# Altium schematic sheet PC104Plus-ESP32-Module.SchDoc: ESP32 PCB
size A3; SheetNumber: 1; SheetTotal: 1
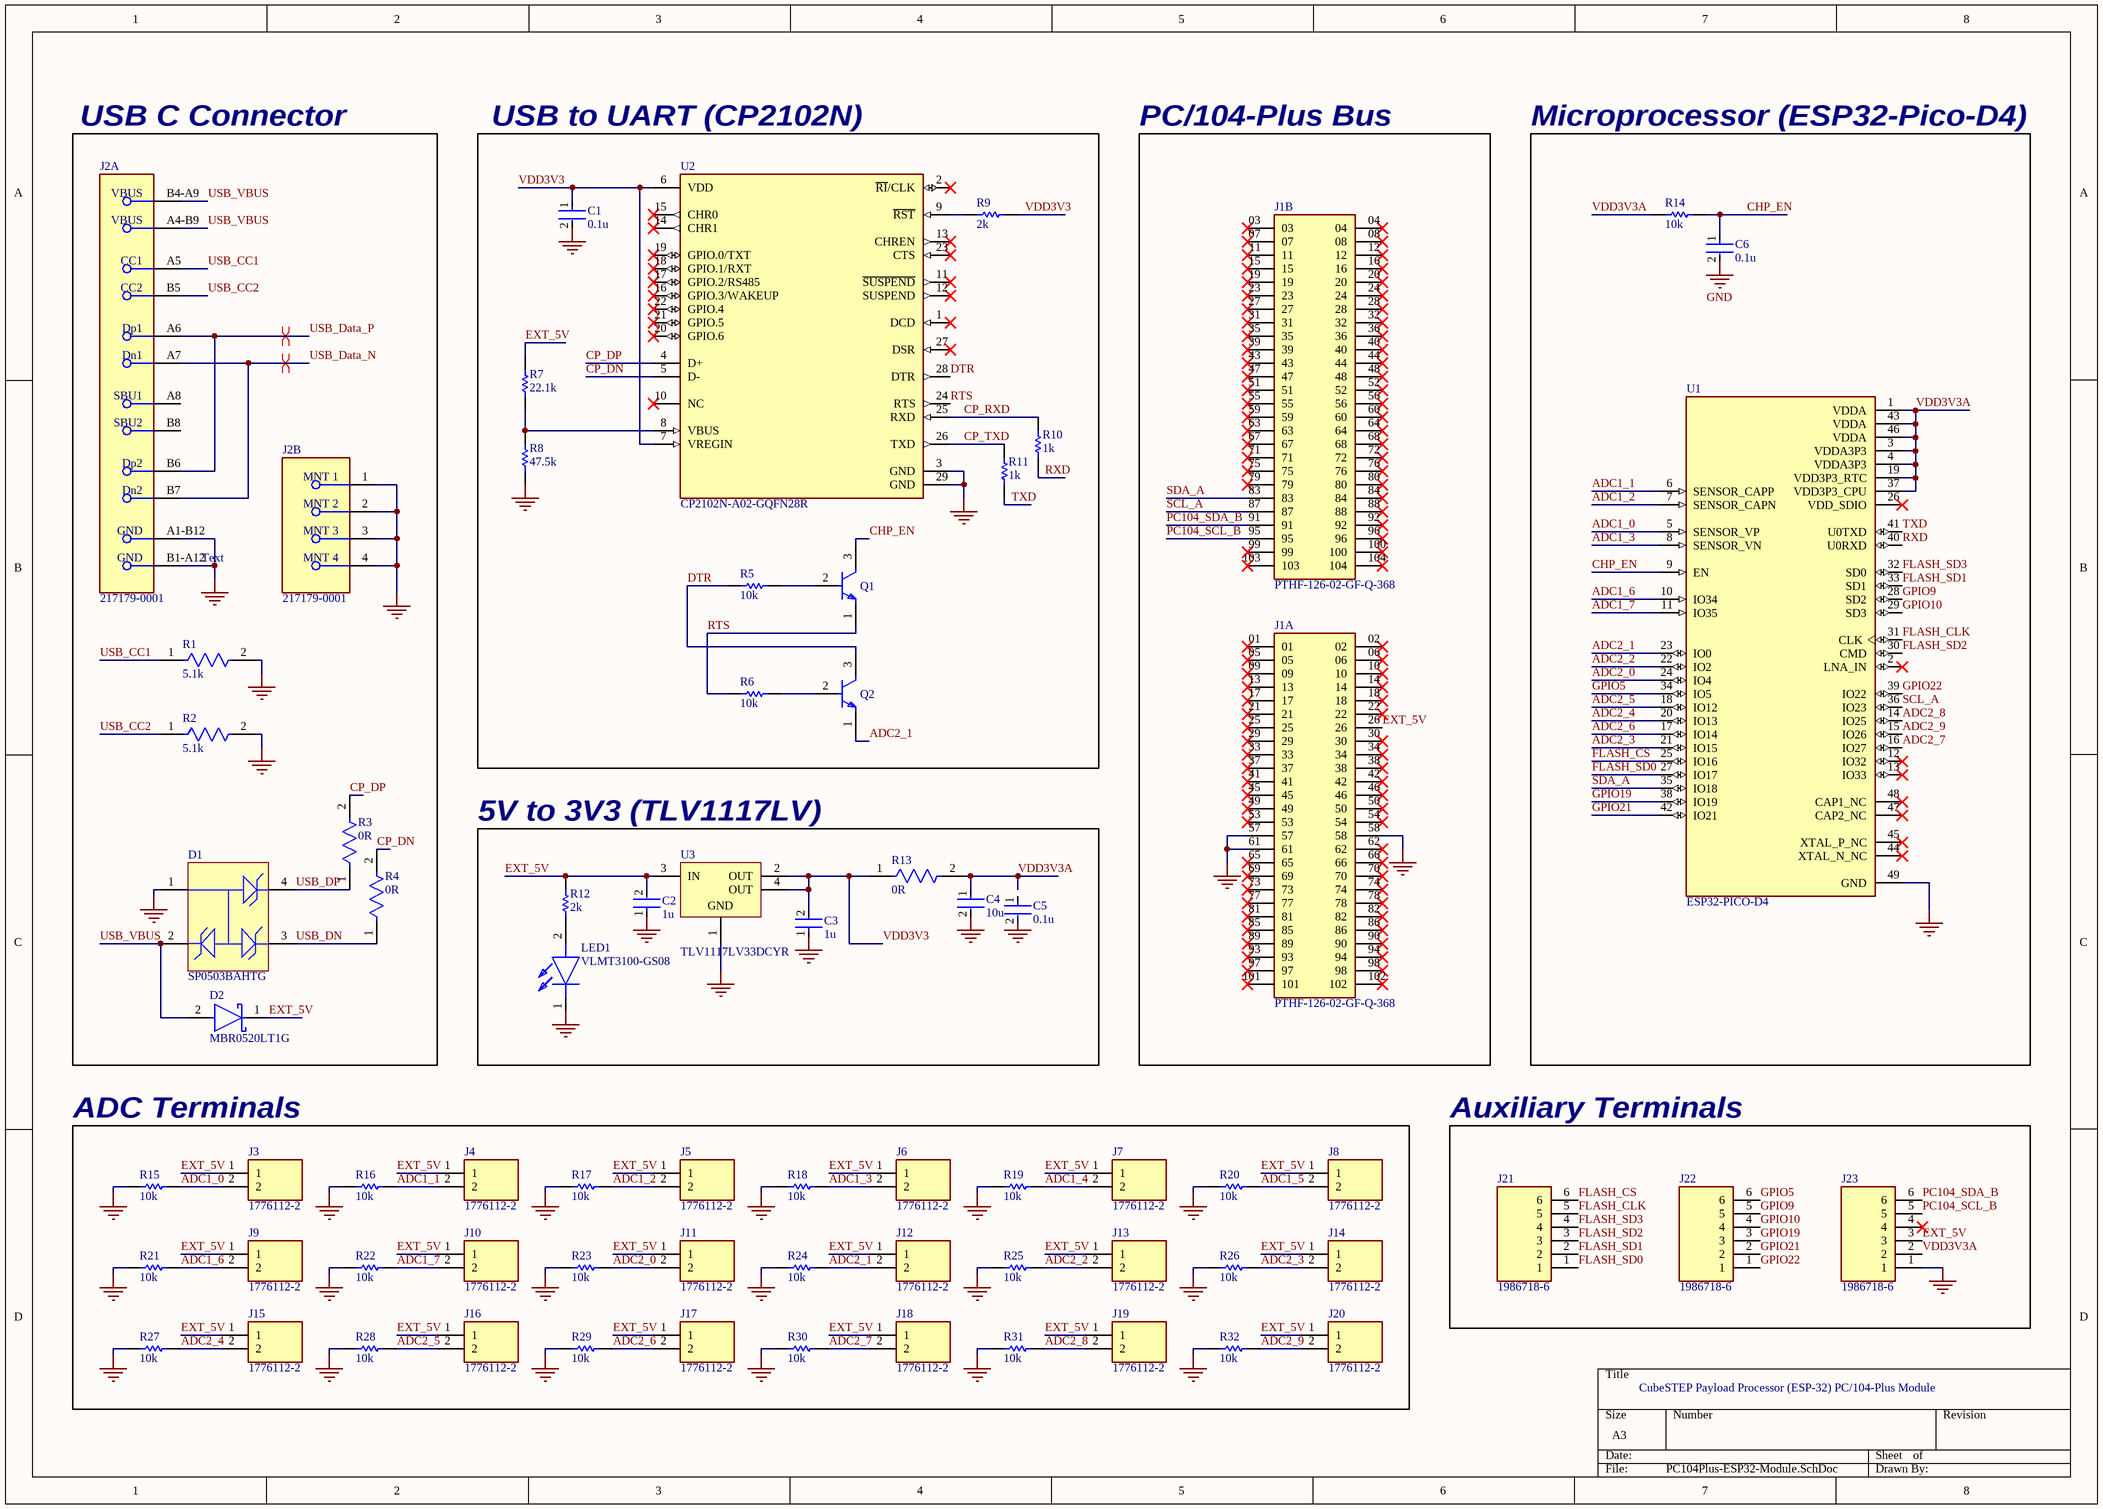
[diagram p0: PC104Plus-ESP32-Module.SchDoc]

## Parts
C1  0.1u  [FP-CL31-IPC_B]
C2  1u  [FP-CL10-IPC_C]
C3  1u  [FP-CL10-IPC_C]
C4  10u  [FP-CL21-IPC_A]
C5  0.1u  [FP-CL31-IPC_B]
C6  0.1u  [FP-CL31-IPC_B]
D1  SP0503BAHTG  [LFUS-SOT143-4_V]
D2  MBR0520LT1G  [FP-425-04-IPC_C]
J1  PTHF-126-02-GF-Q-368  [SAMTEC_PTHF-126-02-GF-Q-368]  (parts A,B of 2)
J2  217179-0001  [FP-217179-0001-MFG]  (parts A,B of 2)
J3  1776112-2  [TE_1776112-2]
J4  1776112-2  [TE_1776112-2]
J5  1776112-2  [TE_1776112-2]
J6  1776112-2  [TE_1776112-2]
J7  1776112-2  [TE_1776112-2]
J8  1776112-2  [TE_1776112-2]
J9  1776112-2  [TE_1776112-2]
J10  1776112-2  [TE_1776112-2]
J11  1776112-2  [TE_1776112-2]
J12  1776112-2  [TE_1776112-2]
J13  1776112-2  [TE_1776112-2]
J14  1776112-2  [TE_1776112-2]
J15  1776112-2  [TE_1776112-2]
J16  1776112-2  [TE_1776112-2]
J17  1776112-2  [TE_1776112-2]
J18  1776112-2  [TE_1776112-2]
J19  1776112-2  [TE_1776112-2]
J20  1776112-2  [TE_1776112-2]
J21  1986718-6  [TE_1986718-6]
J22  1986718-6  [TE_1986718-6]
J23  1986718-6  [TE_1986718-6]
LED1  VLMT3100-GS08  [VLMT3100-GS08]
Q1  SS8050CBU  (value not drawn)
Q2  SS8050CBU  (value not drawn)
R1  5.1k  [FP-ERJ3EK-MFG]
R2  5.1k  [FP-ERJ3EK-MFG]
R3  0R  [FP-ERJ1GN-MFG]
R4  0R  [FP-ERJ1GN-MFG]
R5  10k  [RESC1609X55X30LL15T15]
R6  10k  [RESC1609X55X30LL15T15]
R7  22.1k  [RESC2013X70X40NL20T20]
R8  47.5k  [RESC1005X40X25NL05T05]
R9  2k  [RESC1005X40X25LL05T05]
R10  1k  [RESC2013X70X40ML20T20]
R11  1k  [RESC2013X70X40ML20T20]
R12  2k  [RESC1005X40X25LL05T05]
R13  0R  [FP-ERJ1GN-MFG]
R14  10k  [RESC1609X55X30LL15T15]
R15  10k  [RESC1609X55X30LL15T15]
R16  10k  [RESC1609X55X30LL15T15]
R17  10k  [RESC1609X55X30LL15T15]
R18  10k  [RESC1609X55X30LL15T15]
R19  10k  [RESC1609X55X30LL15T15]
R20  10k  [RESC1609X55X30LL15T15]
R21  10k  [RESC1609X55X30LL15T15]
R22  10k  [RESC1609X55X30LL15T15]
R23  10k  [RESC1609X55X30LL15T15]
R24  10k  [RESC1609X55X30LL15T15]
R25  10k  [RESC1609X55X30LL15T15]
R26  10k  [RESC1609X55X30LL15T15]
R27  10k  [RESC1609X55X30LL15T15]
R28  10k  [RESC1609X55X30LL15T15]
R29  10k  [RESC1609X55X30LL15T15]
R30  10k  [RESC1609X55X30LL15T15]
R31  10k  [RESC1609X55X30LL15T15]
R32  10k  [RESC1609X55X30LL15T15]
U1  ESP32-PICO-D4  [PQFN50P700X700X104-49N]
U2  CP2102N-A02-GQFN28R  [FP-CP2102N-A02-GQFN28R-MFG]
U3  TLV1117LV33DCYR  [DCY0004A_N]

## Blocks framed on the sheet
USB C Connector: D1 D2 J2 R1-R4
USB to UART (CP2102N): C1 Q1 Q2 R5-R11 U2
PC/104-Plus Bus: J1
Microprocessor (ESP32-Pico-D4): C6 R14 U1
5V to 3V3 (TLV1117LV): C2-C5 LED1 R12 R13 U3
ADC Terminals: J3-J20 R15-R32
Auxiliary Terminals: J21-J23

## Nets
GND: C1.2 C2.1 C3.1 C4.2 C5.2 C6.2 D1.1 J1.57 J1.58 J1.61 J2.1(MNT_1) J2.2(MNT_2) J2.3(MNT_3) J2.4(MNT_4) J2.A1-B12(GND) J2.B1-A12(GND) J23.1 LED1.1(K) R1.2 R2.2 R8.1 R15.2 R16.2 R17.2 R18.2 R19.2 R20.2 R21.2 R22.2 R23.2 R24.2 R25.2 R26.2 R27.2 R28.2 R29.2 R30.2 R31.2 R32.2 U1.49(GND) U2.3(GND) U2.29(GND) U3.1(GND)
ADC1_0: J3.2 R15.1 U1.5(SENSOR_VP)
ADC1_1: J4.2 R16.1 U1.6(SENSOR_CAPP)
ADC1_2: J5.2 R17.1 U1.7(SENSOR_CAPN)
ADC1_3: J6.2 R18.1 U1.8(SENSOR_VN)
ADC1_4: J7.2 R19.1
ADC1_5: J8.2 R20.1
ADC1_6: J9.2 R21.1 U1.10(IO34)
ADC1_7: J10.2 R22.1 U1.11(IO35)
ADC2_0: J11.2 R23.1 U1.24(IO4)
ADC2_1: J12.2 Q2.1(E) R24.1 U1.23(IO0)
ADC2_2: J13.2 R25.1 U1.22(IO2)
ADC2_3: J14.2 R26.1 U1.21(IO15)
ADC2_4: J15.2 R27.1 U1.20(IO13)
ADC2_5: J16.2 R28.1 U1.18(IO12)
ADC2_6: J17.2 R29.1 U1.17(IO14)
ADC2_7: J18.2 R30.1 U1.16(IO27)
ADC2_8: J19.2 R31.1 U1.14(IO25)
ADC2_9: J20.2 R32.1 U1.15(IO26)
CHP_EN: C6.1 Q1.3(C) R14.1 U1.9(EN)
CP_DN: R4.2 U2.5(D-)
CP_DP: R3.2 U2.4(D+)
CP_RXD: R10.1 U2.25(RXD)
CP_TXD: R11.1 U2.26(TXD)
DTR: Q2.3(C) R5.2 U2.28(DTR)
EXT_5V: C2.2 D2.1(C) J1.26 J3.1 J4.1 J5.1 J6.1 J7.1 J8.1 J9.1 J10.1 J11.1 J12.1 J13.1 J14.1 J15.1 J16.1 J17.1 J18.1 J19.1 J20.1 J23.3 R7.2 R12.2 U3.3(IN)
FLASH_CLK: J21.5 U1.31(CLK)
FLASH_CS: J21.6 U1.25(IO16)
FLASH_SD0: J21.1 U1.27(IO17)
FLASH_SD1: J21.2 U1.33(SD1)
FLASH_SD2: J21.3 U1.30(CMD)
FLASH_SD3: J21.4 U1.32(SD0)
GPIO5: J22.6 U1.34(IO5)
GPIO9: J22.5 U1.28(SD2)
GPIO10: J22.4 U1.29(SD3)
GPIO19: J22.3 U1.38(IO19)
GPIO21: J22.2 U1.42(IO21)
GPIO22: J22.1 U1.39(IO22)
PC104_SCL_B: J1.95 J23.5
PC104_SDA_B: J1.91 J23.6
RTS: Q1.1(E) R6.2 U2.24(RTS)
RXD: R10.2 U1.40(U0RXD)
SCL_A: J1.87 U1.36(IO23)
SDA_A: J1.83 U1.35(IO18)
TXD: R11.2 U1.41(U0TXD)
USB_CC1: J2.A5(CC1) R1.1
USB_CC2: J2.B5(CC2) R2.1
USB_Data_N: J2.A7(Dn1) J2.B7(Dn2)
USB_Data_P: J2.A6(Dp1) J2.B6(Dp2)
USB_DN: D1.3 R4.1
USB_DP: D1.4 R3.1
USB_VBUS: D1.2 D2.2(A) J2.A4-B9(VBUS) J2.B4-A9(VBUS)
VDD3V3: C1.1 C3.2 R9.2 R13.1 U2.6(VDD) U2.7(VREGIN) U3.2(OUT) U3.4(OUT)
VDD3V3A: C4.1 J23.2 R13.2 R14.2 U1.1(VDDA) U1.3(VDDA3P3) U1.4(VDDA3P3) U1.19(VDD3P3_RTC) U1.37(VDD3P3_CPU) U1.43(VDDA) U1.46(VDDA)
NetLED1_2: LED1.2(A) R12.1
NetQ1_2: Q1.2(B) R5.1
NetQ2_2: Q2.2(B) R6.1
NetR7_1: R7.1 R8.2 U2.8(VBUS)
NetR9_1: R9.1 U2.9(~{RST})

Not connected (* = marked no-connect by the designer): C5 1; J1 01* 02* 03* 04* 05* 06* 07* 08* 09* 10* 11* 12* 13* 14* 15* 16* 17* 18* 19* 20* 21* 22* 23* 24* 25* 27* 28* 29* 30* 31* 32* 33* 34* 35* 36* 37* 38* 39* 40* 41* 42* 43* 44* 45* 46* 47* 48* 49* 50* 51* 52* 53* 54* 55* 56* 59* 60* 62* 63* 64* 65* 66* 67* 68* 69* 70* 71* 72* 73* 74* 75* 76* 77* 78* 79* 80* 81* 82* 84* 85* 86* 88* 89* 90* 92* 93* 94* 96* 97* 98* 99* 100* 101* 102* 103* 104*; J2 A8(SBU1) B8(SBU2); J23 4*; U1 2(LNA_IN)* 12(IO32)* 13(IO33)* 26(VDD_SDIO)* 44(XTAL_N_NC)* 45(XTAL_P_NC)* 47(CAP2_NC)* 48(CAP1_NC)*; U2 1(DCD)* 2(~{RI}/CLK)* 10(NC)* 11(~{SUSPEND})* 12(SUSPEND)* 13(CHREN)* 14(CHR1)* 15(CHR0)* 16(GPIO.3/WAKEUP)* 17(GPIO.2/RS485)* 18(GPIO.1/RXT)* 19(GPIO.0/TXT)* 20(GPIO.6)* 21(GPIO.5)* 22(GPIO.4)* 23(CTS)* 27(DSR)*

## Layout directives
differential pair: USB_Data_N, USB_Data_P

## Notes on the sheet
- (near J2) Text
- CubeSTEP Payload Processor (ESP-32) PC/104-Plus Module

## Library data of the parts
C1 C5 C6 = CMP-13271-001662-1: Cap Ceramic 1uF 50V X7R ±10% SMD 1206 +125°C Embossed T/R; Case Code (Metric): 3216; Packaging: Tape and Reel; Depth: 1.6mm; Max Operating Temperature: 125°C; Length: 3.2mm; Contact Plating: Tin; Voltage Rating (DC): 50V; Radiation Hardening: No; Min Operating Temperature: -55°C; Dielectric: X7R; Voltage: 50V; Lead Free: Lead Free; Capacitance: 1uF; Package Quantity: 1; Material: Ceramic; Thickness: 0.071inch; Width: 0.063inch; Voltage Rating: 50V; Case Code (Imperial): 1206; Mount: Surface Mount; Case/Package: 1206; Tolerance: 10%; Height: 1.6mm
C2 C3 = CMP-13271-003399-1: Cap Ceramic 1uF 10V X5R ±10% Pad SMD 0603 +85°C T/R; Min Operating Temperature: -55°C; Max Operating Temperature: 85°C; Dielectric: X5R; Contact Plating: Tin; Height: 0.8mm; Voltage: 10V; Packaging: Tape and Reel; Voltage Rating: 10V; Capacitance: 1uF; Package Quantity: 1; Width: 0.031inch; Length: 1.6mm; Depth: 0.8mm; Case/Package: 0603; Case Code (Imperial): 0603; Thickness: 0.035inch; Radiation Hardening: No; Tolerance: 10%; Case Code (Metric): 1608; Mount: Surface Mount
C4 = CMP-13271-002240-1: CL21 Series 0805 10uF 16V ±10% Tolerance X5R Multilayer Ceramic Chip Capacitor; Capacitance: 10uF; Case Code (Metric): 2012; Package Quantity: 3000; Width: 0.049inch; Mount: Surface Mount; Depth: 1.25mm; Material: Ceramic; Min Operating Temperature: -55°C; Thickness: 0.053inch; Tolerance: 10%; Case Code (Imperial): 0805; Packaging: Tape and Reel; Voltage Rating: 16V; Case/Package: 0805; Height: 1.25mm; Voltage: 16V; Max Operating Temperature: 85°C; Length: 2mm; Dielectric: X5R
D1 = CMP-2000-05191-1: TVS Diode Array, 30 pF, 30 KV, -40 to 85 degC, 4-Pin SOT143, RoHS, Tape and Reel; Manufacturer: Littelfuse; Direction Type: Uni-Directional; Product Height (mm): 1.05mm; Leakage Current (Max): 0.1uA; Clamping Voltage (Max): 8V; Reverse Stand-off Voltage: 5.5(Min)V; Configuration: Triple; Working Voltage: 5.5V; Product Length (mm): 3.04mm; Working Voltage (Max): 5.5V(Min); Capacitance Value: 30pF; Rad Hardened: No; Number of Elements: 3; Product Depth (mm): 1.4mm; Operating Temperature Max Deg. C: 85C; Suppressor Type: TVS; Operating Temperature Min Deg. C: -40C; Operating Temp Range: -40Cto85C; Mounting: SurfaceMount; Package / Case: SOT-143; Datasheet Version: Dec-13; Package Type: SOT-143; Packaging: TapeandReel; Pin Count: 3+Tab; Operating Temperature Classification: Industrial; Datasheet URL: https://datasheet.ciiva.com/15143/getdatasheetpartid-116020-15143550.pdf; Manufacturer URL: http://www.littelfuse.com/; Leakage Current: 0.1uA; Mounting Style: SurfaceMount; Clamping Voltage: 8V; Polarity: Uni-Directional
D2 = CMP-1055-00425-2: DIODE SCHOTTKY 20V 500MA SOD123; Polarity: Standard; Peak Non-Repetitive Surge Current: 5.5A; Forward Voltage: 385mV; Element Configuration: Single; Peak Reverse Current: 250uA; Max Repetitive Reverse Voltage (Vrrm): 20V; Voltage Rating (DC): 20V; Case/Package: SOD-123-2; Number of Pins: 2; Output Current: 500mA; Min Operating Temperature: -65°C; Lead Free: Lead Free; REACH SVHC: No SVHC; Max Reverse Voltage (DC): 20V; Termination: SMD/SMT; Average Rectified Current: 500mA; Max Surge Current: 5.5A; Package Quantity: 3000; Height: 1.12mm; Current Rating: 500mA; Forward Current: 500mA; Max Forward Surge Current (Ifsm): 5.5A; Packaging: Tape and Reel; Length: 2.69mm; Radiation Hardening: No; Max Reverse Leakage Current: 250uA; Width: 1.6mm; Contact Plating: Tin; Max Operating Temperature: 125°C
J1 = PTHF-126-02-GF-Q-368: MF: {'manufacturer': u'Samtec'}; Package: None; Price: None; Value: *; MP: PTHF-126-02-GF-Q-368; Availability: Unavailable
J2 = CMP-04767-000028-1: CONN RCP USB2.0 TYP C 24P SMD RA
J3-J20 = 1776112-2: 2P,3.50MM,SIDE ENTRY,HIGH TMP; Number_of_Positions: 2; Centerline_Pitch: 3.5 mm[.138 in]; MF: TE Connectivity; SnapEDA_Link: https://www.snapeda.com/parts/1776112-2/TE%20Connectivity%20AMP%20Connectors/view-part/592263/?ref=snap; Value: *; Digi-Key_Purchase_URL: https://www.digikey.com/product-detail/en/te-connectivity-amp-connectors/1776112-2/A97973-ND/1826836?utm_source=snapeda&utm_medium=aggregator&utm_campaign=symbol; MP: 1776112-2; EU_RoHS_Compliance: Compliant; Digi-Key_Part_Number: A97973-ND; TE_purchase_URL: https://www.te.com/usa-en/product-1776112-2.html?te_bu=Cor&te_type=disp&te_campaign=seda_glo_cor-seda-global-disp-prtnr-fy19-seda-model-bom-cta_sma-317_1&elqCampaignId=32493; Package: None
J21-J23 = 1986718-6: HEADER, 6P, 3.5 PCB 16.5 H WB; MF: {'manufacturer': u'TE Connectivity'}; Package: None; Price: None; Value: *; MP: 1986718-6; Availability: Unavailable
LED1 = VLMT3100-GS08: LED; Manufacturer_Name: Vishay; Datasheet Link: https://datasheet.datasheetarchive.com/originals/distributors/Datasheets-DGA13/1163816.pdf; Manufacturer_Part_Number: VLMT3100-GS08; Mouser Part Number: 78-VLMT3100; Mouser Price/Stock: https://www.mouser.co.uk/ProductDetail/Vishay-Semiconductors/VLMT3100-GS08?qs=0a36Zf3k4G%252BVBROXbJBpfw%3D%3D; Arrow Part Number: VLMT3100-GS08; Arrow Price/Stock: https://www.arrow.com/en/products/vlmt3100-gs08/vishay?region=nac
R1 R2 = CMP-2000-00540-8: RES SMD 5.1K OHM 1% 1/10W 0603; Power Rating: 100mW; Temperature Coefficient: 100ppm/°C; Voltage Rating: 75V; Resistance: 5.1kR; Military Standard: Not; Case/Package: 0603; Packaging: Tape and Reel; Package Quantity: 1; Reach SVHC Compliant: Yes; Lead Free: Lead Free; Mount: Surface Mount; Size Code: 0603; Depth: 0.8mm; Resistance Tolerance: 1%; Number of Terminations: 2; Resistor Type: Thick Film; Width: 0.8mm; Construction: Rectangular; Series: ERJ; Radiation Hardening: No; Max Operating Temperature: 155°C; Features: Automotive AEC-Q200; Tolerance: 1%; Voltage Rating (DC): 75V; Length: 1.6mm; RoHS Compliant: Yes; Min Operating Temperature: -55°C; Case Code (Metric): 1608; Termination: SMD/SMT; Weight: 7.1E-05oz; Max Power Dissipation: 100mW; Contact Plating: Tin; Height: 0.022inch; Case Code (Imperial): 0603
R3 R4 R13 = CMP-1010-00001-3: RES SMD 0 OHM JUMPER 1/20W 0201; Temperature Coefficient: 600ppm/°C; Max Power Dissipation: 50mW; Voltage Rating: 25V; Tolerance: 1%; Package Quantity: 15000; Case Code (Imperial): 0201; Number of Terminations: 2; Depth: 0.3mm; Lead Free: Lead Free; Military Standard: Not; Width: 0.3mm; Resistance: 0R; Series: ERJ; Max Operating Temperature: 125°C; Construction: Rectangular; Contact Plating: Tin; RoHS Compliant: Yes; Height: 0.23mm; Voltage Rating (DC): 25V; Mount: Surface Mount; Min Operating Temperature: -55°C; Power Rating: 50mW; Features: Automotive AEC-Q200; Resistor Type: Thick Film; Case/Package: 0201; Case Code (Metric): 0603; Length: 0.6mm; Packaging: Tape and Reel
R5 R6 R14-R32 = CMP-1012-00623-3: Chip Resistor, 10 KOhm, +/- 1%, 0.1 W, -55 to 155 degC, 0603 (1608 Metric), RoHS, Tape and Reel; Manufacturer: Panasonic; Voltage Rating: 75V; Case\/Package: 0603; Power Rating: 100mW; Resistance: 10KOhm; Temperature Coefficient: 100ppm\/degreesC; Number of Pins: 2; Package Reference: 603; Depth: 0.8mm; Mount: SurfaceMount; Package Description: 2-Pin Surface Mount Device, Body 1.6 x 0.85 mm; Datasheet Version: 02/2017; Length: 1.6mm; Lead Free: LeadFree; Height: 0.45mm; Number of Terminations: 2; Max Power Dissipation: 100mW; Min Operating Temperature: -55degC; Datasheet URL: https://industrial.panasonic.com/cdbs/www-data/pdf/RDA0000/AOA0000C304.pdf; Termination: SMD/SMT; Case Code (Metric): 1608; Case Code (Imperial): 0603; Tolerance: 1%; Max Operating Temperature: 155degC; RoHSCompliant: true; Voltage Rating (DC): 75V; Radiation Hardening: No; Packaging: TapeandReel; Composition: ThickFilm; Mounting Technology: SurfaceMount; Manufacturer URL: http://www.panasonic.com/; Width: 0.031inch; REACH SVHC: NoSVHC; Contact Plating: Tin; Military Standard: Not; Package Quantity: 1
R7 = CMP-2001-00049-1: Part Number: ERJ-6ENF2212V; Manufacturer: Panasonic
R8 = CMP-2002-00959-1: Part Number: ERJ-2RKF47R5X; Manufacturer: Panasonic
R9 R12 = CMP-1011-00081-2: Part Number: ERJ-2GEJ202X; Manufacturer: Panasonic
R10 R11 = CMP-2001-04375-5: Chip Resistor, 1 KOhm, +/- 1%, 0.125 W, -55 to 155 degC, 0805 (2012 Metric), RoHS, Tape and Reel; Manufacturer: Panasonic; Voltage Rating: 150 V; ComponentLink1URL: http://www.panasonic.com/; ComponentLink2Description: Datasheet; REACH SVHC: Yes; ComponentLink1Description: Manufacturer URL; Length: 2 mm; Height: 0.6 mm; Package Quantity: 1; PackageDescription: 2-Pin Surface Mount Device, Body 2 x 1.25 mm; Packaging: Cut Tape; PackageReference: 0805; Max Operating Temperature: 155 degC; Mounting Technology: Surface Mount; ComponentLink2URL: http://industrial.panasonic.com/cdbs/www-data/pdf/RDA0000/AOA0000C86.pdf; DatasheetVersion: 04/2015; Min Operating Temperature: -55 degC; RoHSCompliant: true; Mount: Surface Mount
U1 = ESP32-PICO-D4: Bluetooth, WiFi 802.11b/g/n, Bluetooth v4.2 +EDR, Class 1, 2 and 3 Transceiver Module 2.4GHz ~ 2.5GHz Surface Mount; Value: *; Availability: Unavailable; Price: None; MP: ESP32-PICO-D4; Package: None
U2 = CMP-08093-000007-1: IC USB TO UART BRIDGE QFN28
U3 = CMP-0395-00503-2: Single Output LDO, 1 A, Fixed 3.3 V Output, 2 to 5.5 V Input, 4-pin SOT-223 (DCY), -40 to 125 degC, Green (RoHS & no Sb/Br); Manufacturer: Texas Instruments; Vout Adj(Min)(V): 3.3; Vdo(Typ)(mV): 1200; Iq(Typ)(mA): 0.05; Accuracy(%): 2; Iout(Max)(A): 1; SubFamily: Single Channel LDO; Vin(Max)(V): 5.5; PackageReference: DCY0004A; PackageDescription: 4-Pin Plastic Small Outline, Body 3.5 x 6.5 mm, Pitch 2.3 mm; Vout Adj(Max)(V): 3.3; Mounting Technology: Surface Mount; ComponentLink2Description: Datasheet; ComponentLink1Description: Manufacturer URL; PartNumber: TLV1117LV33DCYR; ComponentLink3Description: Package Specification; ComponentLink1URL: http://www.ti.com/; ComponentLink2URL: http://www.ti.com/general/docs/lit/getliterature.tsp?genericPartNumber=TLV1117LV33&fileType=pdf; Fixed Output Options(V): 3.3; PackageVersion: 4202506/B; Vin(Min)(V): 2; DatasheetVersion: SBVS160A; Eco-Plan: Green (RoHS & no Sb/Br); ComponentLink3URL: http://www.ti.com/litv/pdf/mpds094a; Code_JEDEC: TO-261